# EAGLE design RS232Converter (EAGLE 6.3)
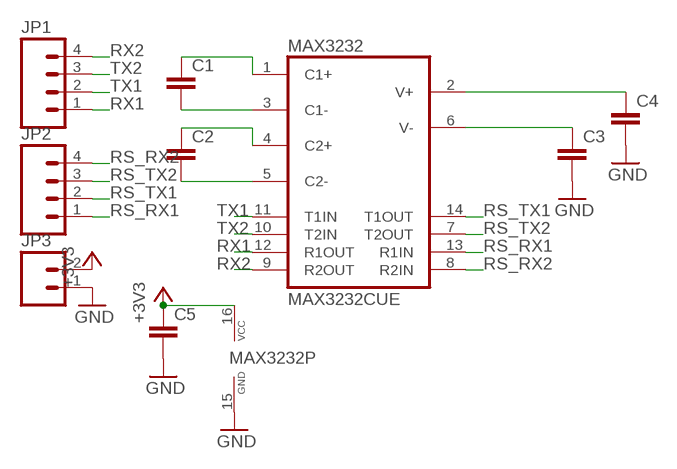
[diagram p0: schematic, sheet 1]

## Parts
C1  CAP0603-CAP  [0603-CAP]
C2  CAP0603-CAP  [0603-CAP]
C3  CAP0603-CAP  [0603-CAP]
C4  CAP0603-CAP  [0603-CAP]
C5  CAP0603-CAP  [0603-CAP]
JP1  M04PTH  [1X04]
JP2  M04PTH  [1X04]
JP3  M02PTH  [1X02]
MAX3232  MAX3232CUE  [TSSOP16]

## Nets
+3V3: C5.1 JP3.2 MAX3232.16(VCC)
GND: C3.2 C4.2 C5.2 JP3.1 MAX3232.15(GND)
N$1: C1.1 MAX3232.1(C1+)
N$2: C1.2 MAX3232.3(C1-)
N$3: C2.1 MAX3232.4(C2+)
N$4: C3.1 MAX3232.6(V-)
N$5: C4.1 MAX3232.2(V+)
N$6: C2.2 MAX3232.5(C2-)
RS_RX1: JP2.1 MAX3232.13(R1IN)
RS_RX2: JP2.4 MAX3232.8(R2IN)
RS_TX1: JP2.2 MAX3232.14(T1OUT)
RS_TX2: JP2.3 MAX3232.7(T2OUT)
RX1: JP1.1 MAX3232.12(R1OUT)
RX2: JP1.4 MAX3232.9(R2OUT)
TX1: JP1.2 MAX3232.11(T1IN)
TX2: JP1.3 MAX3232.10(T2IN)

## Library data of the parts
C1-C5 = SparkFun-Passives:CAP: Capacitor Standard 0603 ceramic capacitor, and 0.1" leaded capacitor.
JP1 JP2 = SparkFun-Connectors:M04: Header 4 Standard 4-pin 0.1" header. Use with straight break away headers (SKU : PRT-00116), right angle break away headers (PRT-00553), swiss pins (PRT-00743), machine pins (PRT-00117), and female headers (PRT-00115). Molex polarized connector foot print use with SKU : PRT-08231 with associated crimp pins and housings. 1MM SMD Version SKU: PRT-10208
JP3 = SparkFun-Connectors:M02: Header 2 Standard 2-pin 0.1" header. Use with straight break away headers (SKU : PRT-00116), right angle break away headers (PRT-00553), swiss pins (PRT-00743), machine pins (PRT-00117), and female headers (PRT-00115). Molex polarized connector foot print use with SKU : PRT-08233 with associated crimp pins and housings.
MAX3232 = maxim:MAX3232*: True RS-232 Transceivers 3.0V to 5.5V, Low-Power up to 1Mbps, Using Four 0.1µF External Capacitors Source: http://pdfserv.maxim-ic.com/en/ds/MAX3222-MAX3241.pdf; MF: MAXIM; MPN: MAX3232CUE+; OC_FARNELL: 1593350; OC_NEWARK: 68K4629

## Board
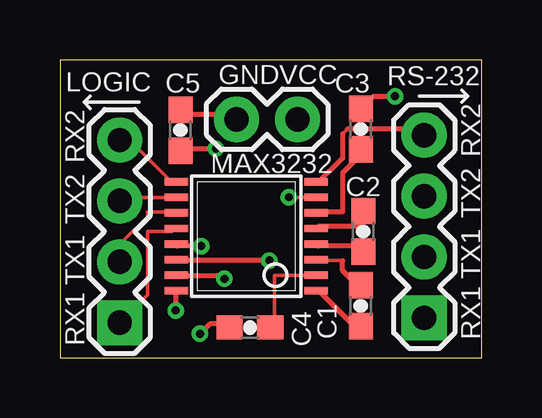
[diagram p1: board, top side]
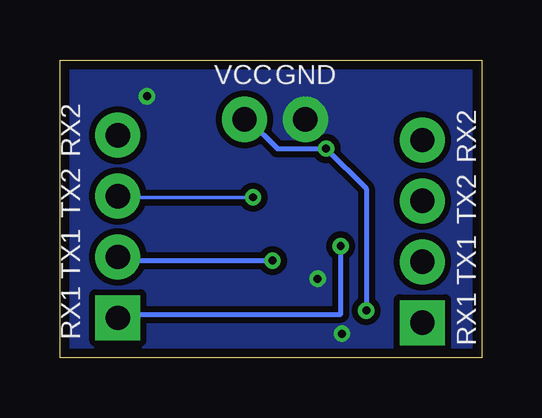
[diagram p2: board, bottom side, seen from below]

Size 17.6 x 12.44 mm. Coordinates in mm from the lower left corner, seen from the top.
Outline: 0,0 17.6,0 17.6,12.44 0,12.44 0,0
Copper layers (1*16): Top 0.0356mm / dielectric 1.5011mm / Bottom 0.0356mm
Design rules "LaenPCBOrder *": minimum track width 6mil, minimum drill 13mil, track to track 6mil, track to pad 6mil, pad to pad 6mil, via to via 6mil, smd to smd 6mil, copper to edge 15mil, drill to drill 6mil, minimum pad ring 7mil, minimum via ring 7mil, stop-mask expansion 4mil, vias tented up to drill 13mil, thermal gap 10mil

### Footprints (pad centres in the part's own frame; a part is rotated, then mirrored left to right if it is on the bottom)
0603-CAP = smd 1.1 x 1: 1 -0.85,0; 2 0.85,0
1X04 = drill 1.016 pad 1.88 square: 1 0,0 | drill 1.016 pad 1.88: 2 2.54,0; 3 5.08,0; 4 7.62,0
1X02 = drill 1.016 pad 1.88: 1 0,0; 2 2.54,0
TSSOP16 = smd 0.305 x 0.991: 1 -2.275,-2.918; 2 -1.625,-2.918; 3 -0.975,-2.918; 4 -0.325,-2.918; 5 0.325,-2.918; 6 0.975,-2.918; 7 1.625,-2.918; 8 2.275,-2.918; 9 2.275,2.918; 10 1.625,2.918; 11 0.975,2.918; 12 0.325,2.918; 13 -0.325,2.918; 14 -0.975,2.918; 15 -1.625,2.918; 16 -2.275,2.918

### Placement (x,y rotation side)
C1  12.55,2.18 90 top
C2  12.65,5.28 90 top
C3  12.55,9.55 90 top
C4  7.92,1.27 180 top
C5  5.03,9.5 90 top
JP1  2.49,1.47 90 top
JP2  15.19,1.68 90 top
JP3  7.37,9.96 0 top
MAX3232  7.77,5.08 90 top

### Tracks (layer width: path | path; a pad name or v marks a point on that pad's centre or on a via)
+3V3  (via drill 0.33)
  Top 0.152: 4.67,2.85 MAX3232.16 | 4.88,8.74 C5.1
  Top 0.203: C5.1 5.12,8.74 v6.5,8.74 | MAX3232.16 4.83,2.78 v4.83,1.98
  Bottom 0.203: JP3.2 9.75,9.96 8.53,8.74 v6.5,8.74 4.83,7.06 v4.83,1.98
GND  (via drill 0.33)
  Top 0.152: 4.88,3.45 MAX3232.15 | 6.91,1.42 C4.2 | 4.88,10.16 C5.2 | 7.32,9.96 JP3.1 | 12.39,10.36 C3.2
  Top 0.203: 4.88,10.16 7.32,10.16 7.32,9.96 | 7.52,9.96 JP3.1 | C3.2 13.07,10.92 v13.97,10.92 | 6.91,1.42 6.25,1.42 v5.84,1.02 | 4.88,3.45 6.71,3.45 v6.86,3.3
  pour Bottom (isolate 0.254, no thermals): 0,0 0,12.45 17.53,12.45 17.53,0
N$1
  Top 0.152: 10.77,2.85 MAX3232.1 | 12.39,1.22 C1.1
  Top 0.203: 12.39,1.22 10.77,2.85
N$2
  Top 0.152: 11.79,4.06 10.77,4.06 MAX3232.3 | 12.39,3.05 C1.2
  Top 0.203: 11.79,4.06 11.79,3.66 12.39,3.05
N$3
  Top 0.152: 12.6,4.67 12.6,4.47 C2.1 | 10.77,4.67 MAX3232.4
  Top 0.203: 12.6,4.67 10.77,4.67
N$4
  Top 0.152: 12.39,8.33 12.39,8.53 C3.1 | 10.77,6.1 MAX3232.6
  Top 0.203: 10.77,6.1 11.79,6.1 11.79,7.72 12.39,8.33
N$5
  Top 0.152: MAX3232.2 10.57,3.45 8.94,3.45 8.94,1.42 C4.1
N$6
  Top 0.152: 10.77,5.49 MAX3232.5 | 12.6,6.1 C2.2
  Top 0.203: 10.77,5.49 12.6,5.49 12.6,6.1
RS_RX1  (via drill 0.33)
  Top 0.152: 4.88,4.67 MAX3232.13
  Top 0.203: v5.89,4.67 4.88,4.67
  Bottom 0.152: 15.04,1.83 JP2.1
  Bottom 0.203: v5.89,4.67 5.89,1.83 15.04,1.83
RS_RX2
  Top 0.152: 11.99,9.55 11.79,9.35 | 10.77,7.32 MAX3232.8
  Top 0.203: 10.77,7.32 11.79,8.33 11.79,9.35 | 11.99,9.55 15.04,9.55 15.04,9.35 JP2.4
RS_TX1  (via drill 0.33)
  Top 0.152: 4.88,4.06 MAX3232.14
  Top 0.203: v8.74,4.06 4.88,4.06
  Bottom 0.152: 15.04,4.06 JP2.2
  Bottom 0.203: 15.04,4.06 v8.74,4.06
RS_TX2  (via drill 0.33)
  Top 0.152: v9.55,6.71 10.57,6.71 MAX3232.7
  Bottom 0.152: v9.55,6.71 15.04,6.71 JP2.3
RX1
  Top 0.152: JP1.1 3.66,2.64 3.66,5.28 4.67,5.28 MAX3232.12
RX2
  Top 0.152: MAX3232.9 4.67,7.32 3.05,8.94 2.64,8.94 JP1.4
TX1
  Top 0.152: MAX3232.11 4.67,6.1 3.66,6.1 3.66,5.89 2.64,4.88 2.64,4.06 JP1.2
TX2
  Top 0.152: MAX3232.10 4.67,6.71 2.64,6.71 JP1.3

### Text on the board
tNames: LOGIC | RS-232 | GND | VCC | RX2 | RX2 | TX2 | TX2 | TX1 | TX1 | RX1 | RX1
bNames: GND | VCC | RX2 | RX2 | TX2 | TX2 | TX1 | TX1 | RX1 | RX1